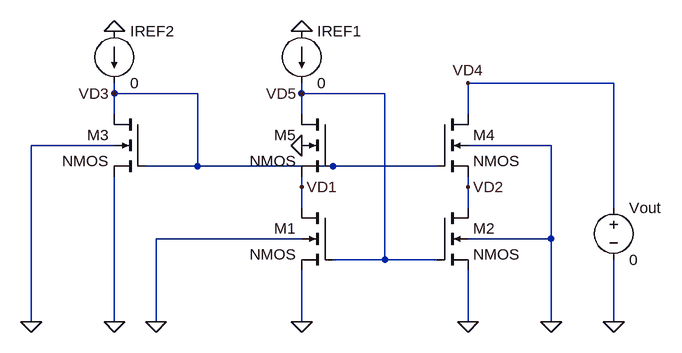
[diagram p0: schematic Chapter03D_04.fig.asc]
Chapter03D_04.fig.asc, the LTspice schematic file:
Version 4
SHEET 1 2940 740
WIRE 256 -144 32 -144
WIRE -512 -128 -512 -144
WIRE -384 -128 -512 -128
WIRE -224 -128 -224 -144
WIRE -96 -128 -224 -128
WIRE -512 -96 -512 -128
WIRE -224 -96 -224 -128
WIRE 32 -96 32 -144
WIRE -512 -48 -640 -48
WIRE 160 -48 32 -48
WIRE -384 -16 -384 -128
WIRE -384 -16 -464 -16
WIRE -176 -16 -384 -16
WIRE -16 -16 -176 -16
WIRE -224 16 -224 0
WIRE 32 16 32 0
WIRE -224 48 -224 16
WIRE 32 48 32 16
WIRE 256 48 256 -144
WIRE -224 96 -448 96
WIRE 160 96 160 -48
WIRE 160 96 32 96
WIRE -96 128 -96 -128
WIRE -96 128 -176 128
WIRE -16 128 -96 128
WIRE -640 224 -640 -48
WIRE -512 224 -512 0
WIRE -448 224 -448 96
WIRE -224 224 -224 144
WIRE 32 224 32 144
WIRE 160 224 160 96
WIRE 256 224 256 128
FLAG -224 224 0
FLAG -448 224 0
FLAG 32 224 0
FLAG 160 224 0
FLAG 256 224 0
FLAG -224 -224 0
FLAG 32 -144 VD4
FLAG -640 224 0
FLAG -512 224 0
FLAG -512 -224 0
FLAG -224 -48 0
FLAG -224 16 VD1
FLAG 32 16 VD2
FLAG -224 -128 VD5
FLAG -512 -128 VD3
SYMBOL nmos4 -176 48 M0
SYMATTR InstName M1
SYMBOL nmos4 -16 48 R0
SYMATTR InstName M2
SYMBOL voltage 256 32 R0
SYMATTR InstName Vout
SYMATTR Value 0
SYMBOL current -224 -224 R0
WINDOW 123 0 0 Left 0
WINDOW 39 0 0 Left 0
SYMATTR InstName IREF1
SYMATTR Value 0
SYMBOL nmos4 -464 -96 M0
SYMATTR InstName M3
SYMBOL nmos4 -16 -96 R0
SYMATTR InstName M4
SYMBOL current -512 -224 R0
WINDOW 123 0 0 Left 0
WINDOW 39 0 0 Left 0
SYMATTR InstName IREF2
SYMATTR Value 0
SYMBOL nmos4 -176 -96 M0
SYMATTR InstName M5

The netlist it stands for:
* Chapter03D_04.fig.asc
M1 VD1 VD5 0 0 NMOS
M2 VD2 VD5 0 0 NMOS
Vout VD4 0 0
IREF1 0 VD5 0
M3 VD3 VD3 0 0 NMOS
M4 VD4 VD3 VD2 0 NMOS
IREF2 0 VD3 0
M5 VD5 VD3 VD1 0 NMOS
.model NMOS NMOS
.model PMOS PMOS
.lib standard.mos
.backanno
.end